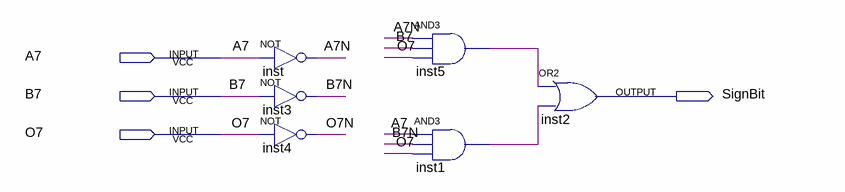
[diagram p0: schematic sheet]
// Quartus schematic SignBit.bdf as structural Verilog: 6 symbols, 4 pins
module SignBit (
  input  A7,
  input  B7,
  input  O7,
  output SignBit
);

  wire A7N, B7N, inst1_out, inst5_out, O7N;

  not inst (A7N, A7);
  not inst3 (B7N, B7);
  not inst4 (O7N, O7);
  and inst5 (inst5_out, A7N, B7, O7);
  and inst1 (inst1_out, A7, B7N, O7);
  or inst2 (SignBit, inst5_out, inst1_out);
endmodule
